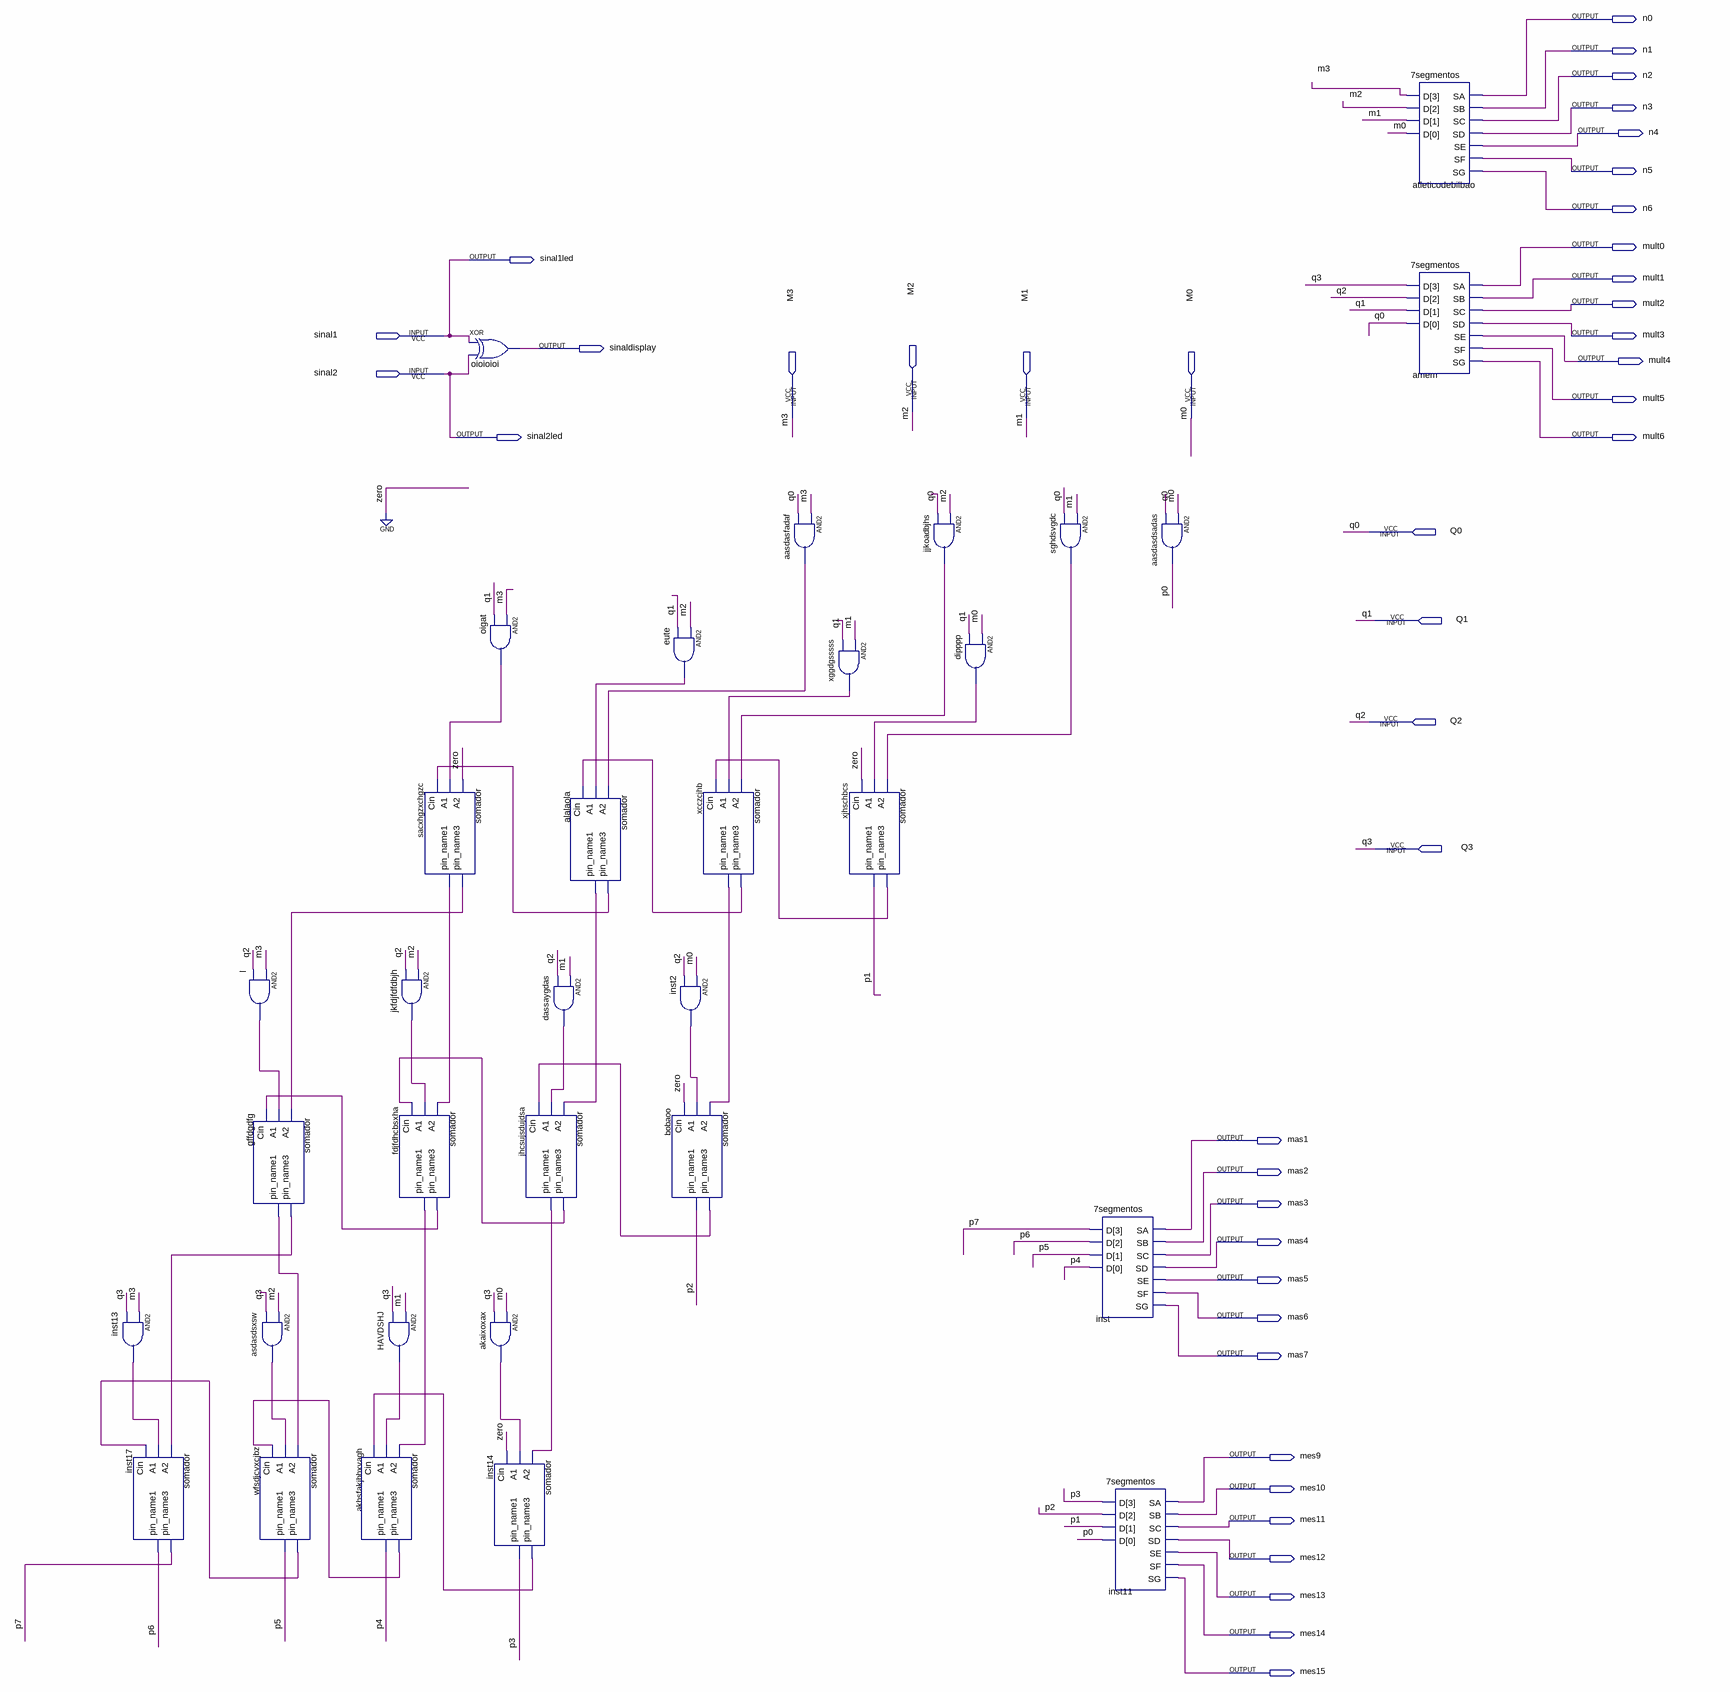
[diagram p0: schematic sheet]
// Quartus schematic multiplicador.bdf as structural Verilog: 33 symbols, 41 pins
module multiplicador (
  input  sinal1,
  input  sinal2,
  input  M2,
  input  M3,
  input  M1,
  input  M0,
  input  Q0,
  input  Q1,
  input  Q2,
  input  Q3,
  output n0,
  output n1,
  output n2,
  output n3,
  output n4,
  output n5,
  output n6,
  output mult0,
  output sinal1led,
  output mult1,
  output mult2,
  output mult3,
  output sinaldisplay,
  output mult4,
  output mult5,
  output sinal2led,
  output mult6,
  output mas1,
  output mas2,
  output mas3,
  output mas4,
  output mas5,
  output mas6,
  output mas7,
  output mes9,
  output mes10,
  output mes11,
  output mes12,
  output mes13,
  output mes14,
  output mes15
);

  wire aasdasfadaf_out, akaixoxax_out, akhsfakjbhxvagh_pin_name3, alalaola_pin_name1, alalaola_pin_name3,
       asdasdsxsw_out, bobaoo_pin_name3, dassaygdas_out, dipppp_out, eute_out, fdjfdhcbsxha_pin_name1,
       fdjfdhcbsxha_pin_name3, gffdgdfg_pin_name1, gffdgdfg_pin_name3, HAVDSHJ_out, inst2_out, inst13_out,
       inst14_pin_name3, jhcsujsdujdsa_pin_name1, jhcsujsdujdsa_pin_name3, jjkoadbjhs_out, jkfdjfdfdbjh_out,
       l_out, oigat_out, p0, p1, p2, p3, p4, p5, p6, p7, sacxhgzxchgzc_pin_name1, sacxhgzxchgzc_pin_name3,
       sghdsvgdc_out, wfsdjcvxcjbz_pin_name3, xcczcjhb_pin_name1, xcczcjhb_pin_name3, xggdgsssss_out,
       xjhschbcs_pin_name3;

  and inst13 (inst13_out, M3, Q3);
  somador inst17 (
    .A2(gffdgdfg_pin_name3), .A1(inst13_out), .Cin(wfsdjcvxcjbz_pin_name3), .pin_name3(p7), .pin_name1(p6));
  and l (l_out, M3, Q2);
  somador gffdgdfg (
    .A2(sacxhgzxchgzc_pin_name3), .A1(l_out), .Cin(fdjfdhcbsxha_pin_name3), .pin_name3(gffdgdfg_pin_name3),
    .pin_name1(gffdgdfg_pin_name1));
  and asdasdsxsw (asdasdsxsw_out, M2, Q3);
  somador wfsdjcvxcjbz (
    .A2(gffdgdfg_pin_name1), .A1(asdasdsxsw_out), .Cin(akhsfakjbhxvagh_pin_name3),
    .pin_name3(wfsdjcvxcjbz_pin_name3), .pin_name1(p5));
  somador akhsfakjbhxvagh (
    .A2(fdjfdhcbsxha_pin_name1), .A1(HAVDSHJ_out), .Cin(inst14_pin_name3),
    .pin_name3(akhsfakjbhxvagh_pin_name3), .pin_name1(p4));
  somador sacxhgzxchgzc (
    .A2(1'b0), .A1(oigat_out), .Cin(alalaola_pin_name3), .pin_name3(sacxhgzxchgzc_pin_name3),
    .pin_name1(sacxhgzxchgzc_pin_name1));
  and jkfdjfdfdbjh (jkfdjfdfdbjh_out, M2, Q2);
  somador fdjfdhcbsxha (
    .A2(sacxhgzxchgzc_pin_name1), .A1(jkfdjfdfdbjh_out), .Cin(jhcsujsdujdsa_pin_name3),
    .pin_name3(fdjfdhcbsxha_pin_name3), .pin_name1(fdjfdhcbsxha_pin_name1));
  and HAVDSHJ (HAVDSHJ_out, M1, Q3);
  xor oioioioi (sinaldisplay, sinal1, sinal2);
  and oigat (oigat_out, M3, Q1);
  somador jhcsujsdujdsa (
    .A2(alalaola_pin_name1), .A1(dassaygdas_out), .Cin(bobaoo_pin_name3),
    .pin_name3(jhcsujsdujdsa_pin_name3), .pin_name1(jhcsujsdujdsa_pin_name1));
  and akaixoxax (akaixoxax_out, M0, Q3);
  somador inst14 (
    .A2(jhcsujsdujdsa_pin_name1), .A1(akaixoxax_out), .Cin(1'b0), .pin_name3(inst14_pin_name3), .pin_name1(p3));
  somador alalaola (
    .A2(aasdasfadaf_out), .A1(eute_out), .Cin(xcczcjhb_pin_name3), .pin_name3(alalaola_pin_name3),
    .pin_name1(alalaola_pin_name1));
  and dassaygdas (dassaygdas_out, M1, Q2);
  and eute (eute_out, M2, Q1);
  somador bobaoo (.A2(xcczcjhb_pin_name1), .A1(inst2_out), .Cin(1'b0), .pin_name3(bobaoo_pin_name3), .pin_name1(p2));
  somador xcczcjhb (
    .A2(jjkoadbjhs_out), .A1(xggdgsssss_out), .Cin(xjhschbcs_pin_name3), .pin_name3(xcczcjhb_pin_name3),
    .pin_name1(xcczcjhb_pin_name1));
  and inst2 (inst2_out, M0, Q2);
  and aasdasfadaf (aasdasfadaf_out, M3, Q0);
  and xggdgsssss (xggdgsssss_out, M1, Q1);
  somador xjhschbcs (.A2(sghdsvgdc_out), .A1(dipppp_out), .Cin(1'b0), .pin_name3(xjhschbcs_pin_name3), .pin_name1(p1));
  and jjkoadbjhs (jjkoadbjhs_out, M2, Q0);
  and dipppp (dipppp_out, M0, Q1);
  and sghdsvgdc (sghdsvgdc_out, M1, Q0);
  \7segmentos  inst (.D({p7, p6, p5, p4}), .SA(mas1), .SB(mas2), .SC(mas3), .SD(mas4), .SE(mas5), .SF(mas6), .SG(mas7));
  \7segmentos  inst11 (
    .D({p3, p2, p1, p0}), .SA(mes9), .SB(mes10), .SC(mes11), .SD(mes12), .SE(mes13), .SF(mes14), .SG(mes15));
  and aasdasdsadas (p0, M0, Q0);
  \7segmentos  atleticodebilbao (.D({M3, M2, M1, M0}), .SA(n0), .SB(n1), .SC(n2), .SD(n3), .SE(n4), .SF(n5), .SG(n6));
  \7segmentos  amem (
    .D({Q3, Q2, Q1, Q0}), .SA(mult0), .SB(mult1), .SC(mult2), .SD(mult3), .SE(mult4), .SF(mult5), .SG(mult6));

  assign sinal1led = sinal1;
  assign sinal2led = sinal2;
endmodule
